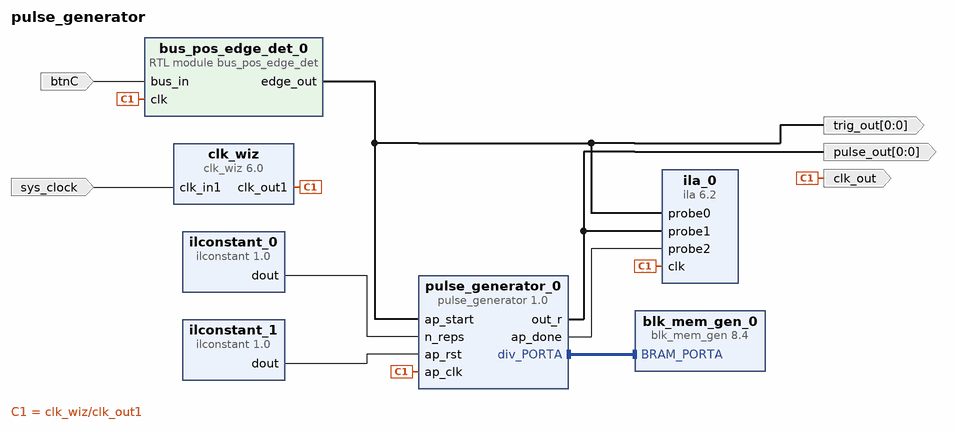
[diagram p0: block diagram of the top level]
# Vivado block design pulse_generator, xc7a35tcpg236-1, Vivado 2026.1
create_bd_design pulse_generator

create_bd_port -dir I -type clk sys_clock
set_property -dict {CONFIG.FREQ_HZ 100000000 CONFIG.PHASE 0.0} [get_bd_ports sys_clock]
create_bd_port -dir O -from 0 -to 0 -type data pulse_out
create_bd_port -dir I btnC
create_bd_port -dir O clk_out
create_bd_port -dir O -from 0 -to 0 trig_out

create_bd_cell -type ip -vlnv xilinx.com:hls:pulse_generator:1.0 pulse_generator_0
create_bd_cell -type ip -vlnv xilinx.com:ip:clk_wiz:6.0 clk_wiz
set_property -dict [list \
  CONFIG.CLKOUT1_JITTER 151.636 \
  CONFIG.CLKOUT1_REQUESTED_OUT_FREQ 50 \
  CONFIG.CLK_IN1_BOARD_INTERFACE sys_clock \
  CONFIG.MMCM_CLKOUT0_DIVIDE_F 20.000 \
  CONFIG.RESET_BOARD_INTERFACE reset \
  CONFIG.USE_BOARD_FLOW true \
] [get_bd_cells clk_wiz]
create_bd_cell -type ip -vlnv xilinx.com:ip:blk_mem_gen:8.4 blk_mem_gen_0
set_property -dict [list \
  CONFIG.Coe_File ../../../../../../../cora-mcs/cora-mcs.srcs/sources_1/new/rom.coe \
  CONFIG.Load_Init_File true \
  CONFIG.Memory_Type Single_Port_ROM \
  CONFIG.use_bram_block BRAM_Controller \
] [get_bd_cells blk_mem_gen_0]
create_bd_cell -type module -reference bus_pos_edge_det bus_pos_edge_det_0
set_property -dict {CONFIG.WIDTH 1} [get_bd_cells bus_pos_edge_det_0]
create_bd_cell -type inline_hdl -vlnv xilinx.com:inline_hdl:ilconstant:1.0 ilconstant_0
set_property -dict {CONFIG.CONST_VAL 100 CONFIG.CONST_WIDTH 32} [get_bd_cells ilconstant_0]
create_bd_cell -type inline_hdl -vlnv xilinx.com:inline_hdl:ilconstant:1.0 ilconstant_1
set_property -dict {CONFIG.CONST_VAL 0} [get_bd_cells ilconstant_1]
create_bd_cell -type ip -vlnv xilinx.com:ip:ila:6.2 ila_0
set_property -dict {CONFIG.C_MONITOR_TYPE Native CONFIG.C_NUM_OF_PROBES 3} [get_bd_cells ila_0]

# ---- connections ----

connect_bd_intf_net [get_bd_intf_pins blk_mem_gen_0/BRAM_PORTA] [get_bd_intf_pins pulse_generator_0/div_PORTA]
connect_bd_net [get_bd_ports btnC] [get_bd_pins bus_pos_edge_det_0/bus_in]
connect_bd_net [get_bd_pins bus_pos_edge_det_0/edge_out] [get_bd_pins pulse_generator_0/ap_start] [get_bd_pins ila_0/probe0] [get_bd_ports trig_out]
connect_bd_net [get_bd_pins clk_wiz/clk_out1] \
  [get_bd_pins pulse_generator_0/ap_clk] [get_bd_pins bus_pos_edge_det_0/clk] [get_bd_pins ila_0/clk] [get_bd_ports clk_out]
connect_bd_net [get_bd_pins ilconstant_0/dout] [get_bd_pins pulse_generator_0/n_reps]
connect_bd_net [get_bd_pins ilconstant_1/dout] [get_bd_pins pulse_generator_0/ap_rst]
connect_bd_net [get_bd_pins pulse_generator_0/ap_done] [get_bd_pins ila_0/probe2]
connect_bd_net [get_bd_pins pulse_generator_0/out_r] [get_bd_ports pulse_out] [get_bd_pins ila_0/probe1]
connect_bd_net [get_bd_ports sys_clock] [get_bd_pins clk_wiz/clk_in1]

validate_bd_design
save_bd_design
